# Altium schematic sheet Conn_A.SchDoc
size A1
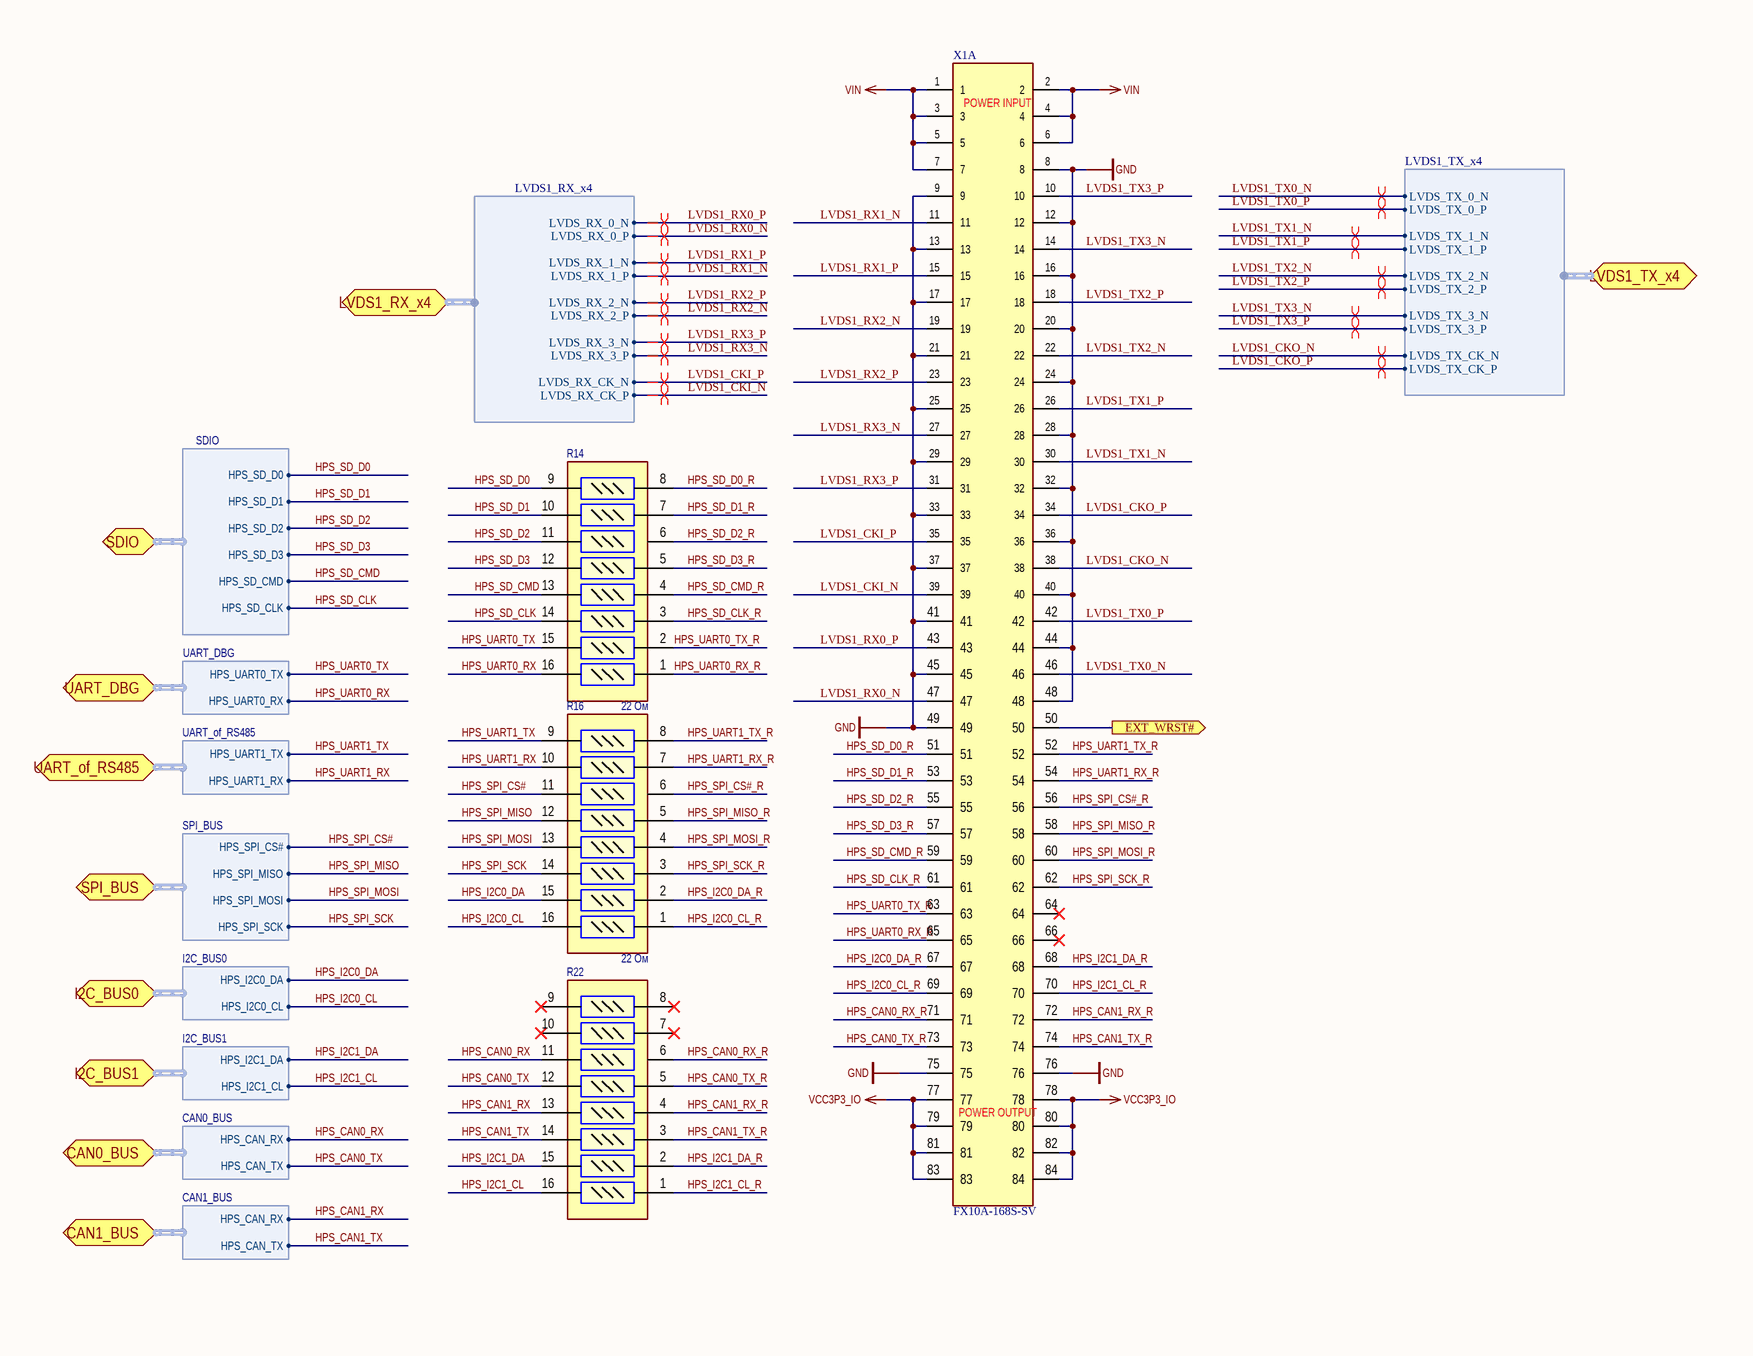
[diagram p0: Conn_A.SchDoc, left]
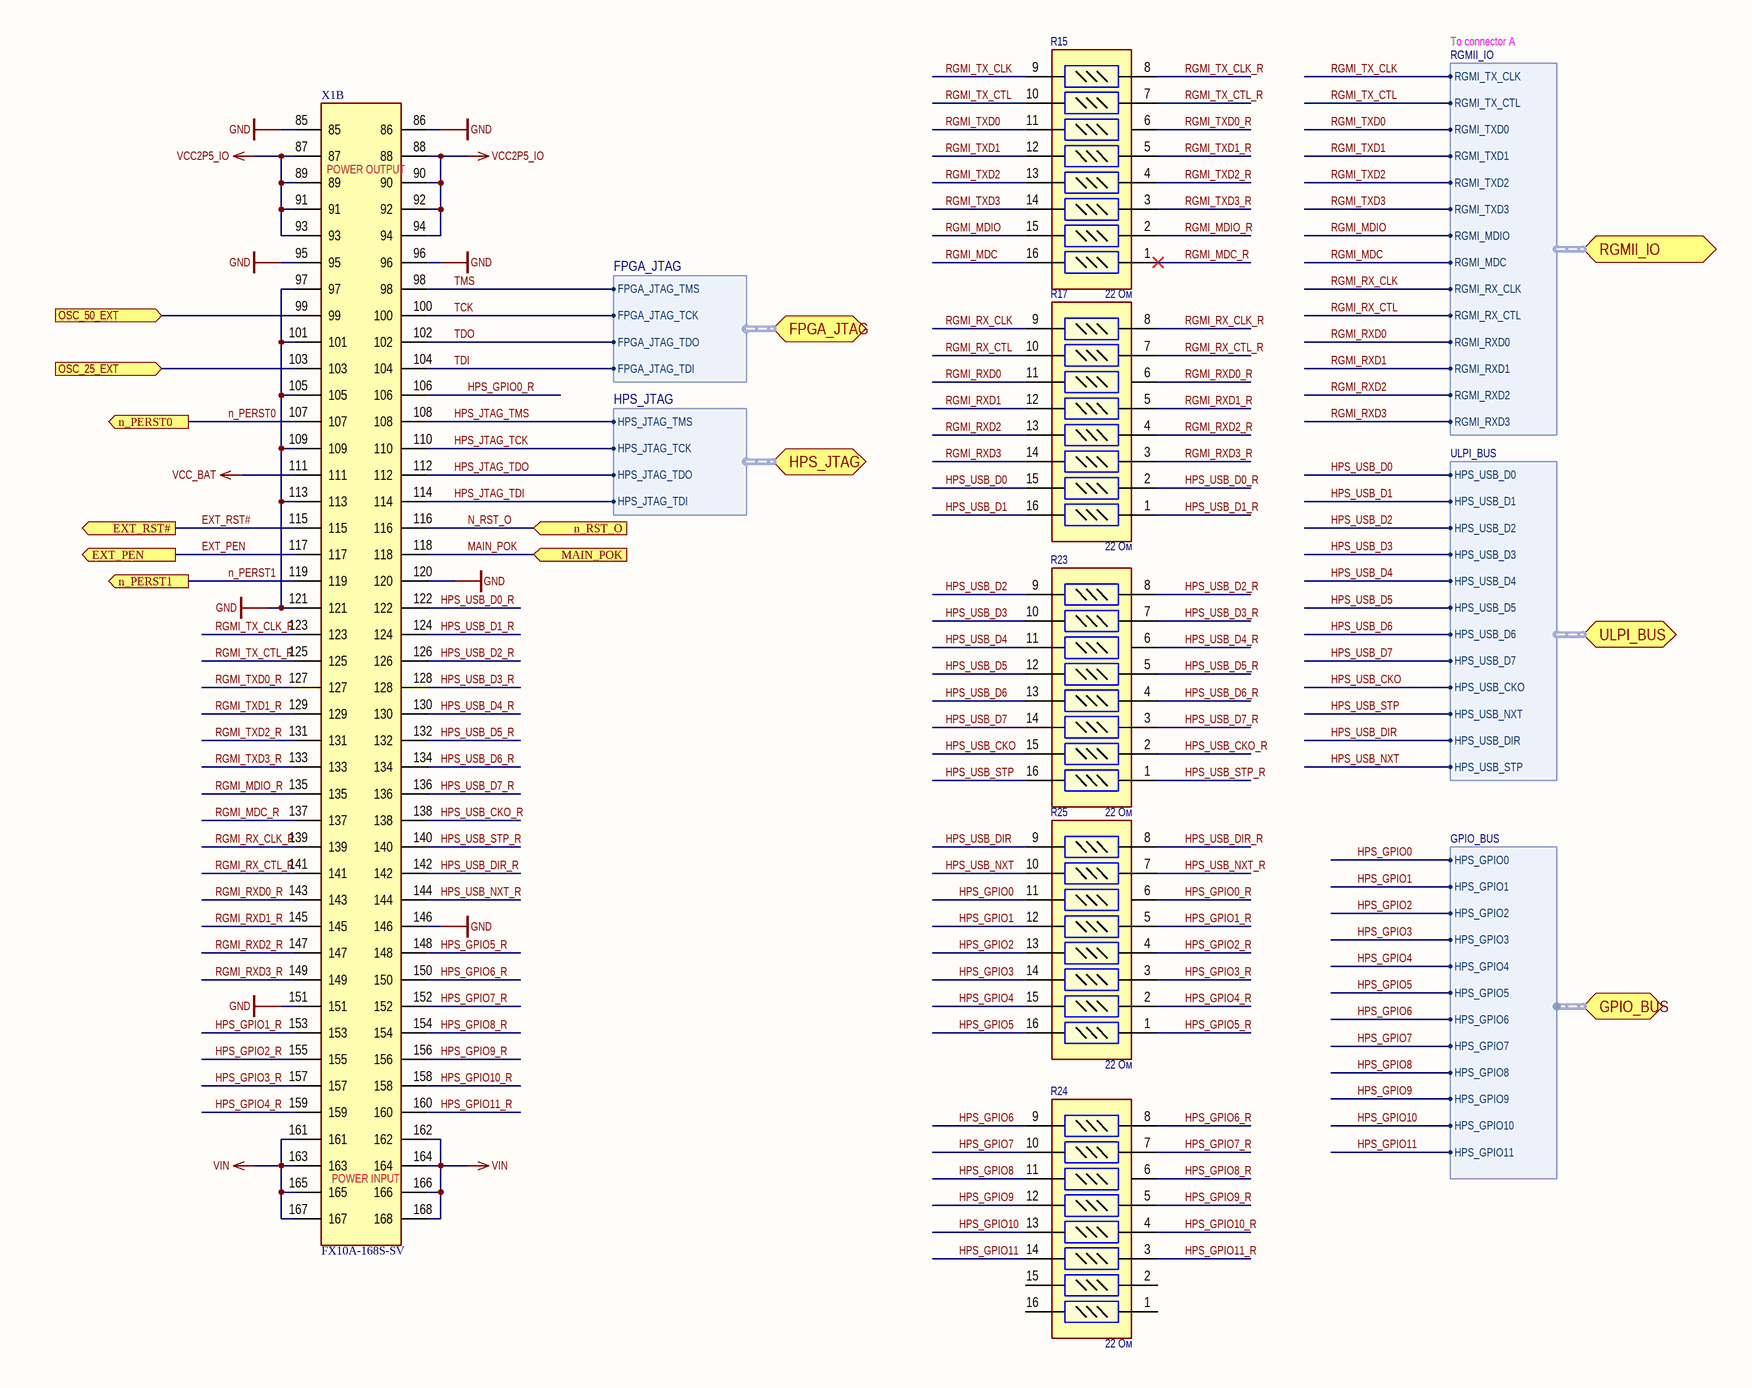
[diagram p1: Conn_A.SchDoc, right]

## Parts
R14  value 22 Ом  [YC248]  (hidden comment: YC248-JR-07-22 Ом)
R15  value 22 Ом  [YC248]  (hidden comment: YC248-JR-07-22 Ом)
R16  value 22 Ом  [YC248]  (hidden comment: YC248-JR-07-22 Ом)
R17  value 22 Ом  [YC248]  (hidden comment: YC248-JR-07-22 Ом)
R22  (no value)  [YC248]
R23  value 22 Ом  [YC248]  (hidden comment: YC248-JR-07-22 Ом)
R24  value 22 Ом  [YC248]  (hidden comment: YC248-JR-07-22 Ом)
R25  value 22 Ом  [YC248]  (hidden comment: YC248-JR-07-22 Ом)
X1  FX10A-168S-SV  [FX10A-168S-SV]  (parts A,B of 2)

## Ports
CAN0_BUS (harness CAN0_BUS), CAN1_BUS (harness CAN1_BUS), EXT_PEN (out), EXT_RST# (out), EXT_WRST# (out), FPGA_JTAG (harness FPGA_JTAG), GPIO_BUS (harness GPIO_BUS), HPS_JTAG (harness HPS_JTAG), I2C_BUS0 (harness I2C_BUS0), I2C_BUS1 (harness I2C_BUS1), LVDS1_RX_x4 (harness LVDS1_RX_x4), LVDS1_TX_x4 (harness LVDS1_TX_x4), MAIN_POK (in), n_PERST0 (out), n_PERST1 (out), n_RST_O (in), OSC_25_EXT (in), OSC_50_EXT (in), RGMII_IO (harness RGMII_IO), SDIO (harness SDIO), SPI_BUS (harness SPI_BUS), UART_DBG (harness UART_DBG), UART_of_RS485 (harness UART_of_RS485), ULPI_BUS (harness ULPI_BUS)

## Harnesses
SDIO: HPS_SD_D0, HPS_SD_D1, HPS_SD_D2, HPS_SD_D3, HPS_SD_CMD, HPS_SD_CLK
ULPI_BUS: HPS_USB_D0, HPS_USB_D1, HPS_USB_D2, HPS_USB_D3, HPS_USB_D4, HPS_USB_D5, HPS_USB_D6, HPS_USB_D7, HPS_USB_CKO, HPS_USB_NXT, HPS_USB_DIR, HPS_USB_STP
UART_of_RS485: HPS_UART1_RX, HPS_UART1_TX
SPI_BUS: HPS_SPI_MOSI, HPS_SPI_MISO, HPS_SPI_SCK, HPS_SPI_CS#
I2C_BUS0: HPS_I2C0_DA, HPS_I2C0_CL
I2C_BUS1: HPS_I2C1_DA, HPS_I2C1_CL
CAN0_BUS: HPS_CAN_TX, HPS_CAN_RX
RGMII_IO: RGMI_TX_CLK, RGMI_TXD0, RGMI_TXD1, RGMI_TXD2, RGMI_TXD3, RGMI_RXD0, RGMI_RXD1, RGMI_RXD2, RGMI_RXD3, RGMI_TX_CTL, RGMI_RX_CTL, RGMI_RX_CLK, RGMI_MDIO, RGMI_MDC
HPS_JTAG: HPS_JTAG_TDI, HPS_JTAG_TDO, HPS_JTAG_TCK, HPS_JTAG_TMS
FPGA_JTAG: FPGA_JTAG_TDI, FPGA_JTAG_TDO, FPGA_JTAG_TCK, FPGA_JTAG_TMS
GPIO_BUS: HPS_GPIO0, HPS_GPIO1, HPS_GPIO2, HPS_GPIO3, HPS_GPIO4, HPS_GPIO5, HPS_GPIO6, HPS_GPIO7, HPS_GPIO8, HPS_GPIO9, HPS_GPIO10, HPS_GPIO11
CAN1_BUS: HPS_CAN_TX, HPS_CAN_RX
LVDS1_TX_x4: LVDS_TX_0_P, LVDS_TX_0_N, LVDS_TX_1_P, LVDS_TX_1_N, LVDS_TX_2_P, LVDS_TX_2_N, LVDS_TX_3_P, LVDS_TX_3_N, LVDS_TX_CK_P, LVDS_TX_CK_N
LVDS1_RX_x4: LVDS_RX_0_P, LVDS_RX_0_N, LVDS_RX_1_P, LVDS_RX_1_N, LVDS_RX_2_P, LVDS_RX_2_N, LVDS_RX_3_P, LVDS_RX_3_N, LVDS_RX_CK_P, LVDS_RX_CK_N
UART_DBG: HPS_UART0_RX, HPS_UART0_TX

## Nets
GND: X1.8 X1.9 X1.12 X1.13 X1.16 X1.17 X1.20 X1.21 X1.24 X1.25 X1.28 X1.29 X1.32 X1.33 X1.36 X1.37 X1.40 X1.41 X1.44 X1.45 X1.48 X1.49 X1.75 X1.76 X1.85 X1.86 X1.95 X1.96 X1.97 X1.101 X1.105 X1.109 X1.113 X1.120 X1.121 X1.146 X1.151
VCC2P5_IO: X1.87 X1.88 X1.89 X1.90 X1.91 X1.92 X1.93 X1.94
VCC3P3_IO: X1.77 X1.78 X1.79 X1.80 X1.81 X1.82 X1.83 X1.84
VCC_BAT: X1.111
VIN: X1.1 X1.2 X1.3 X1.4 X1.5 X1.6 X1.7 X1.161 X1.162 X1.163 X1.164 X1.165 X1.166 X1.167 X1.168
EXT_PEN: X1.117 ; port EXT_PEN
EXT_RST#: X1.115 ; port EXT_RST#
EXT_WRST#: X1.50 ; port EXT_WRST#
HPS_CAN0_RX: R22.11 ; port CAN0_BUS.HPS_CAN_RX
HPS_CAN0_RX_R: R22.6 X1.71
HPS_CAN0_TX: R22.12 ; port CAN0_BUS.HPS_CAN_TX
HPS_CAN0_TX_R: R22.5 X1.73
HPS_CAN1_RX: R22.13 ; port CAN1_BUS.HPS_CAN_RX
HPS_CAN1_RX_R: R22.4 X1.72
HPS_CAN1_TX: R22.14 ; port CAN1_BUS.HPS_CAN_TX
HPS_CAN1_TX_R: R22.3 X1.74
HPS_GPIO0: R25.11 ; port GPIO_BUS.HPS_GPIO0
HPS_GPIO0_R: R25.6 X1.106
HPS_GPIO1: R25.12 ; port GPIO_BUS.HPS_GPIO1
HPS_GPIO1_R: R25.5 X1.153
HPS_GPIO2: R25.13 ; port GPIO_BUS.HPS_GPIO2
HPS_GPIO2_R: R25.4 X1.155
HPS_GPIO3: R25.14 ; port GPIO_BUS.HPS_GPIO3
HPS_GPIO3_R: R25.3 X1.157
HPS_GPIO4: R25.15 ; port GPIO_BUS.HPS_GPIO4
HPS_GPIO4_R: R25.2 X1.159
HPS_GPIO5: R25.16 ; port GPIO_BUS.HPS_GPIO5
HPS_GPIO5_R: R25.1 X1.148
HPS_GPIO6: R24.9 ; port GPIO_BUS.HPS_GPIO6
HPS_GPIO6_R: R24.8 X1.150
HPS_GPIO7: R24.10 ; port GPIO_BUS.HPS_GPIO7
HPS_GPIO7_R: R24.7 X1.152
HPS_GPIO8: R24.11 ; port GPIO_BUS.HPS_GPIO8
HPS_GPIO8_R: R24.6 X1.154
HPS_GPIO9: R24.12 ; port GPIO_BUS.HPS_GPIO9
HPS_GPIO9_R: R24.5 X1.156
HPS_GPIO10: R24.13 ; port GPIO_BUS.HPS_GPIO10
HPS_GPIO10_R: R24.4 X1.158
HPS_GPIO11: R24.14 ; port GPIO_BUS.HPS_GPIO11
HPS_GPIO11_R: R24.3 X1.160
HPS_I2C0_CL: R16.16 ; port I2C_BUS0.HPS_I2C0_CL
HPS_I2C0_CL_R: R16.1 X1.69
HPS_I2C0_DA: R16.15 ; port I2C_BUS0.HPS_I2C0_DA
HPS_I2C0_DA_R: R16.2 X1.67
HPS_I2C1_CL: R22.16 ; port I2C_BUS1.HPS_I2C1_CL
HPS_I2C1_CL_R: R22.1 X1.70
HPS_I2C1_DA: R22.15 ; port I2C_BUS1.HPS_I2C1_DA
HPS_I2C1_DA_R: R22.2 X1.68
HPS_JTAG_TCK: X1.110 ; port HPS_JTAG.HPS_JTAG_TCK
HPS_JTAG_TDI: X1.114 ; port HPS_JTAG.HPS_JTAG_TDI
HPS_JTAG_TDO: X1.112 ; port HPS_JTAG.HPS_JTAG_TDO
HPS_JTAG_TMS: X1.108 ; port HPS_JTAG.HPS_JTAG_TMS
HPS_SD_CLK: R14.14 ; port SDIO.HPS_SD_CLK
HPS_SD_CLK_R: R14.3 X1.61
HPS_SD_CMD: R14.13 ; port SDIO.HPS_SD_CMD
HPS_SD_CMD_R: R14.4 X1.59
HPS_SD_D0: R14.9 ; port SDIO.HPS_SD_D0
HPS_SD_D0_R: R14.8 X1.51
HPS_SD_D1: R14.10 ; port SDIO.HPS_SD_D1
HPS_SD_D1_R: R14.7 X1.53
HPS_SD_D2: R14.11 ; port SDIO.HPS_SD_D2
HPS_SD_D2_R: R14.6 X1.55
HPS_SD_D3: R14.12 ; port SDIO.HPS_SD_D3
HPS_SD_D3_R: R14.5 X1.57
HPS_SPI_CS#: R16.11 ; port SPI_BUS.HPS_SPI_CS#
HPS_SPI_CS#_R: R16.6 X1.56
HPS_SPI_MISO: R16.12 ; port SPI_BUS.HPS_SPI_MISO
HPS_SPI_MISO_R: R16.5 X1.58
HPS_SPI_MOSI: R16.13 ; port SPI_BUS.HPS_SPI_MOSI
HPS_SPI_MOSI_R: R16.4 X1.60
HPS_SPI_SCK: R16.14 ; port SPI_BUS.HPS_SPI_SCK
HPS_SPI_SCK_R: R16.3 X1.62
HPS_UART0_RX: R14.16 ; port UART_DBG.HPS_UART0_RX
HPS_UART0_RX_R: R14.1 X1.65
HPS_UART0_TX: R14.15 ; port UART_DBG.HPS_UART0_TX
HPS_UART0_TX_R: R14.2 X1.63
HPS_UART1_RX: R16.10 ; port UART_of_RS485.HPS_UART1_RX
HPS_UART1_RX_R: R16.7 X1.54
HPS_UART1_TX: R16.9 ; port UART_of_RS485.HPS_UART1_TX
HPS_UART1_TX_R: R16.8 X1.52
HPS_USB_CKO: R23.15 ; port ULPI_BUS.HPS_USB_CKO
HPS_USB_CKO_R: R23.2 X1.138
HPS_USB_D0: R17.15 ; port ULPI_BUS.HPS_USB_D0
HPS_USB_D0_R: R17.2 X1.122
HPS_USB_D1: R17.16 ; port ULPI_BUS.HPS_USB_D1
HPS_USB_D1_R: R17.1 X1.124
HPS_USB_D2: R23.9 ; port ULPI_BUS.HPS_USB_D2
HPS_USB_D2_R: R23.8 X1.126
HPS_USB_D3: R23.10 ; port ULPI_BUS.HPS_USB_D3
HPS_USB_D3_R: R23.7 X1.128
HPS_USB_D4: R23.11 ; port ULPI_BUS.HPS_USB_D4
HPS_USB_D4_R: R23.6 X1.130
HPS_USB_D5: R23.12 ; port ULPI_BUS.HPS_USB_D5
HPS_USB_D5_R: R23.5 X1.132
HPS_USB_D6: R23.13 ; port ULPI_BUS.HPS_USB_D6
HPS_USB_D6_R: R23.4 X1.134
HPS_USB_D7: R23.14 ; port ULPI_BUS.HPS_USB_D7
HPS_USB_D7_R: R23.3 X1.136
HPS_USB_DIR: R25.9 ; port ULPI_BUS.HPS_USB_DIR
HPS_USB_DIR_R: R25.8 X1.142
HPS_USB_NXT: R25.10 ; port ULPI_BUS.HPS_USB_STP
HPS_USB_NXT_R: R25.7 X1.144
HPS_USB_STP: R23.16 ; port ULPI_BUS.HPS_USB_NXT
HPS_USB_STP_R: R23.1 X1.140
LVDS1_CKI_N: X1.39 ; port LVDS1_RX_x4.LVDS_RX_CK_P
LVDS1_CKI_P: X1.35 ; port LVDS1_RX_x4.LVDS_RX_CK_N
LVDS1_CKO_N: X1.38 ; port LVDS1_TX_x4.LVDS_TX_CK_N
LVDS1_CKO_P: X1.34 ; port LVDS1_TX_x4.LVDS_TX_CK_P
LVDS1_RX0_N: X1.47 ; port LVDS1_RX_x4.LVDS_RX_0_P
LVDS1_RX0_P: X1.43 ; port LVDS1_RX_x4.LVDS_RX_0_N
LVDS1_RX1_N: X1.11 ; port LVDS1_RX_x4.LVDS_RX_1_P
LVDS1_RX1_P: X1.15 ; port LVDS1_RX_x4.LVDS_RX_1_N
LVDS1_RX2_N: X1.19 ; port LVDS1_RX_x4.LVDS_RX_2_P
LVDS1_RX2_P: X1.23 ; port LVDS1_RX_x4.LVDS_RX_2_N
LVDS1_RX3_N: X1.27 ; port LVDS1_RX_x4.LVDS_RX_3_P
LVDS1_RX3_P: X1.31 ; port LVDS1_RX_x4.LVDS_RX_3_N
LVDS1_TX0_N: X1.46 ; port LVDS1_TX_x4.LVDS_TX_0_N
LVDS1_TX0_P: X1.42 ; port LVDS1_TX_x4.LVDS_TX_0_P
LVDS1_TX1_N: X1.30 ; port LVDS1_TX_x4.LVDS_TX_1_N
LVDS1_TX1_P: X1.26 ; port LVDS1_TX_x4.LVDS_TX_1_P
LVDS1_TX2_N: X1.22 ; port LVDS1_TX_x4.LVDS_TX_2_N
LVDS1_TX2_P: X1.18 ; port LVDS1_TX_x4.LVDS_TX_2_P
LVDS1_TX3_N: X1.14 ; port LVDS1_TX_x4.LVDS_TX_3_N
LVDS1_TX3_P: X1.10 ; port LVDS1_TX_x4.LVDS_TX_3_P
MAIN_POK: X1.118 ; port MAIN_POK
n_PERST0: X1.107 ; port n_PERST0
n_PERST1: X1.119 ; port n_PERST1
N_RST_O: X1.116 ; port n_RST_O
OSC_25_EXT: X1.103 ; port OSC_25_EXT
OSC_50_EXT: X1.99 ; port OSC_50_EXT
RGMI_MDC: R15.16 ; port RGMII_IO.RGMI_MDC
RGMI_MDC_R: R15.1 X1.137
RGMI_MDIO: R15.15 ; port RGMII_IO.RGMI_MDIO
RGMI_MDIO_R: R15.2 X1.135
RGMI_RX_CLK: R17.9 ; port RGMII_IO.RGMI_RX_CLK
RGMI_RX_CLK_R: R17.8 X1.139
RGMI_RX_CTL: R17.10 ; port RGMII_IO.RGMI_RX_CTL
RGMI_RX_CTL_R: R17.7 X1.141
RGMI_RXD0: R17.11 ; port RGMII_IO.RGMI_RXD0
RGMI_RXD0_R: R17.6 X1.143
RGMI_RXD1: R17.12 ; port RGMII_IO.RGMI_RXD1
RGMI_RXD1_R: R17.5 X1.145
RGMI_RXD2: R17.13 ; port RGMII_IO.RGMI_RXD2
RGMI_RXD2_R: R17.4 X1.147
RGMI_RXD3: R17.14 ; port RGMII_IO.RGMI_RXD3
RGMI_RXD3_R: R17.3 X1.149
RGMI_TX_CLK: R15.9 ; port RGMII_IO.RGMI_TX_CLK
RGMI_TX_CLK_R: R15.8 X1.123
RGMI_TX_CTL: R15.10 ; port RGMII_IO.RGMI_TX_CTL
RGMI_TX_CTL_R: R15.7 X1.125
RGMI_TXD0: R15.11 ; port RGMII_IO.RGMI_TXD0
RGMI_TXD0_R: R15.6 X1.127
RGMI_TXD1: R15.12 ; port RGMII_IO.RGMI_TXD1
RGMI_TXD1_R: R15.5 X1.129
RGMI_TXD2: R15.13 ; port RGMII_IO.RGMI_TXD2
RGMI_TXD2_R: R15.4 X1.131
RGMI_TXD3: R15.14 ; port RGMII_IO.RGMI_TXD3
RGMI_TXD3_R: R15.3 X1.133
TCK: X1.100 ; port FPGA_JTAG.FPGA_JTAG_TCK
TDI: X1.104 ; port FPGA_JTAG.FPGA_JTAG_TDI
TDO: X1.102 ; port FPGA_JTAG.FPGA_JTAG_TDO
TMS: X1.98 ; port FPGA_JTAG.FPGA_JTAG_TMS

Not connected (* = marked no-connect by the designer): R22 7* 8* 9* 10*; R24 1 2 15 16; X1 64* 66*

## Layout directives
differential pair: LVDS1_CKI_N, LVDS1_CKI_P, LVDS1_CKO_N, LVDS1_CKO_P, LVDS1_RX0_N, LVDS1_RX0_P, LVDS1_RX1_N, LVDS1_RX1_P, LVDS1_RX2_N, LVDS1_RX2_P, LVDS1_RX3_N, LVDS1_RX3_P, LVDS1_TX0_N, LVDS1_TX0_P, LVDS1_TX1_N, LVDS1_TX1_P, LVDS1_TX2_N, LVDS1_TX2_P, LVDS1_TX3_N, LVDS1_TX3_P

## Notes on the sheet
- (near X1) POWER INPUT
- To connector A
- (near X1) POWER OUTPUT

## Library data of the parts
R14-R17 R22-R25 = YC248-JR-07-#: Набор чип резисторов; P: 0.062 Вт; Supplier 1: Digi-Key; Supplier Part Number 1: YC248-JR-0722RL